# Altium schematic sheet temperature.SchDoc
size Tabloid
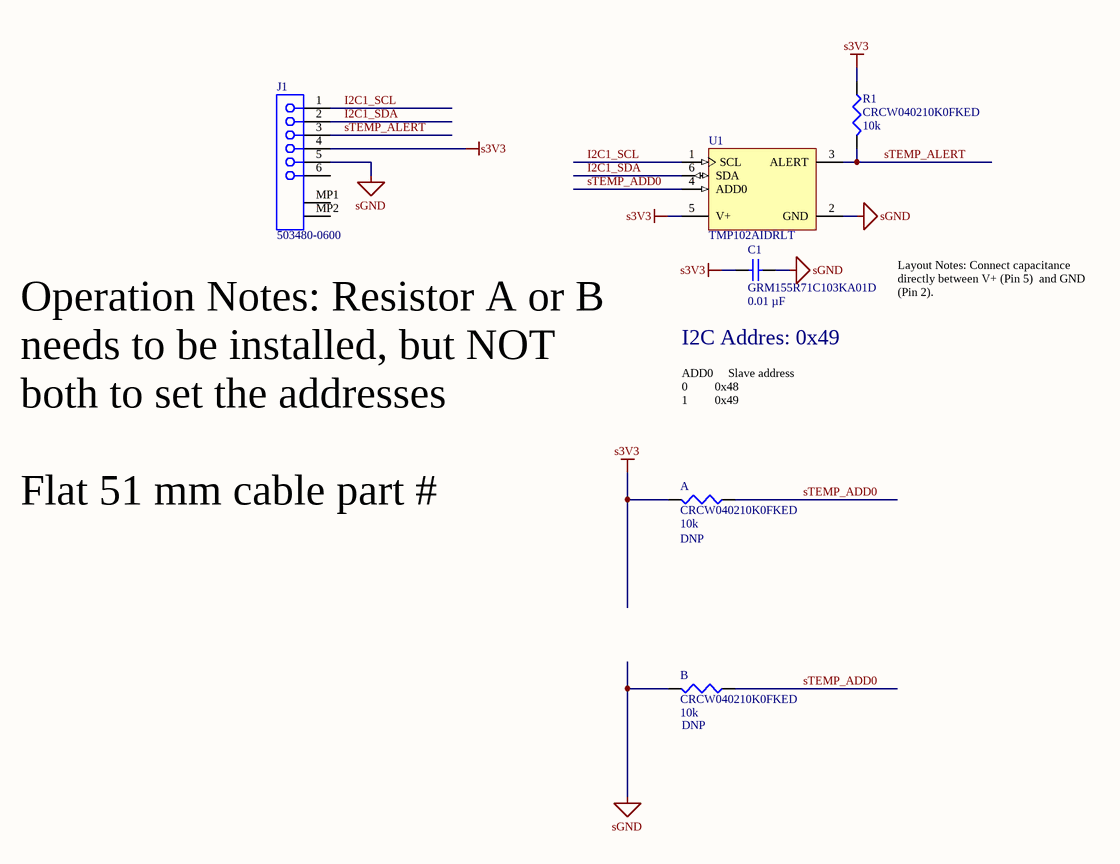
[diagram p0: temperature.SchDoc]

## Parts
A  CRCW040210K0FKED  value 10k  [0402]
B  CRCW040210K0FKED  value 10k  [0402]
C1  GRM155R71C103KA01D  value 0.01 µF  [0402]
J1  503480-0600  [MOLX-503480-0600]
R1  CRCW040210K0FKED  value 10k  [0402]
U1  TMP102AIDRLT  [DRL0006A_L]

## Nets
s3V3: A.2 C1.2 J1.4 R1.1 U1.5(V+)
sGND: B.2 C1.1 J1.5 U1.2(GND)
I2C1_SCL: J1.1 U1.1(SCL)
I2C1_SDA: J1.2 U1.6(SDA)
sTEMP_ADD0: A.1 B.1 U1.4(ADD0)
sTEMP_ALERT: J1.3 R1.2 U1.3(ALERT)

Not connected (* = marked no-connect by the designer): J1 6 MP1 MP2

## Notes on the sheet
- Layout Notes: Connect capacitance directly between V+ (Pin 5)  and GND (Pin 2).
- I2C Addres: 0x49
- ADD0     Slave address
  0         0x48
  1         0x49
- Operation Notes: Resistor A or B needs to be installed, but NOT both to set the addresses
  Flat 51 mm cable part # 15020-0054
- (in symbol CRCW0402xxxxFKED) DNP

## Library data of the parts
A B R1 = CRCW0402xxxxFKED: 0.125W, -55-155C, 1005, 50V, ±1%
C1 = Cap: Cap, 0.01 µF, 16 V, X7R; Published: 8-Jun-2000; LatestRevisionDate: 17-Jul-2002; LatestRevisionNote: Re-released for DXP Platform.; PackageReference: RAD-0.3; Publisher: Altium Limited; PackageDescription: Radial Cap, Thru-Hole; 2 Leads; 0.3 in Pin Spacing
J1 = CMP-1241-00113-1: 0.5 mm Pitch Easy-On(TM) BackFlip(TM) Type FPC Connector, 1.0 mm Mated Height, Right Angle, SMT, Dual Contact, 6 Circuits, -40 to 85 degC, ELV and RoHS Compliant, Tape and Reel; Manufacturer: Molex; Durability (mating cycles max): 10; Voltage (Max): 50V AC (RMS)/DC; PCB Retention: Yes; Material - Plating Termination: Gold, Tin; Mated Height: 1.00mm; Circuits (Loaded): 6; PCB Locator: No; Entry Angle: 90degrees Angle; Current (Max per Contact): 0.5A; Material - Metal: Phosphor Bronze; Pitch - Mating Interface: 0.50mm; Material - Plating Mating: Gold; ComponentLink3Description: Package Specification; Orientation: Right Angle; RoHS: TRUE; ComponentLink1URL: http://www.molex.com/molex/index.jsp; PackageVersion: Rev. F, 09/2012; Packing: Tape and Reel; PackageDescription: 6-Lead FPC Connector, Pitch 0.5 mm; Polarized to PCB: Yes; Number of Rows: 1; ComponentLink2URL: http://www.molex.com/webdocs/datasheets/pdf/en-us/5034800600_FFC_FPC_CONNECTORS.pdf; PackageReference: 503480-0600; Contact Position: Dual; PartNumber: 503480-0600; ComponentLink3URL: http://www.molex.com/pdm_docs/sd/5034800600_sd.pdf; ComponentLink2Description: Datasheet; Mounting Technology: Surface Mount; ComponentLink1Description: Manufacturer URL; Stackable: No
U1 = CMP-1685-00013-1: Low Power Digital Temperature Sensor with SMBus and Two-Wire Serial Interface, 1.4 to 3.6 V, -40 to 125 degC, 6-Pin SOT (DRL), Green (RoHS & no Sb/Br), Tape and Reel; ComponentLink3URL: http://www.ti.com/lit/ml/mpds159c/mpds159c.pdf; PackageVersion: 4205622-3/D, 08/2207; ComponentLink2Description: Datasheet; PackageReference: DRL0006A; ComponentLink2URL: http://www.ti.com/lit/ds/symlink/tmp102.pdf; ComponentLink3Description: Package Specification; ComponentLink1Description: Manufacturer URL; DatasheetVersion: SBOS397F, 12/2015; PackageDescription: 6-Pin Plastic Small Outline, Body 1.6 x 1.2 mm, Pitch 0.5 mm; ComponentLink1URL: http://www.ti.com/